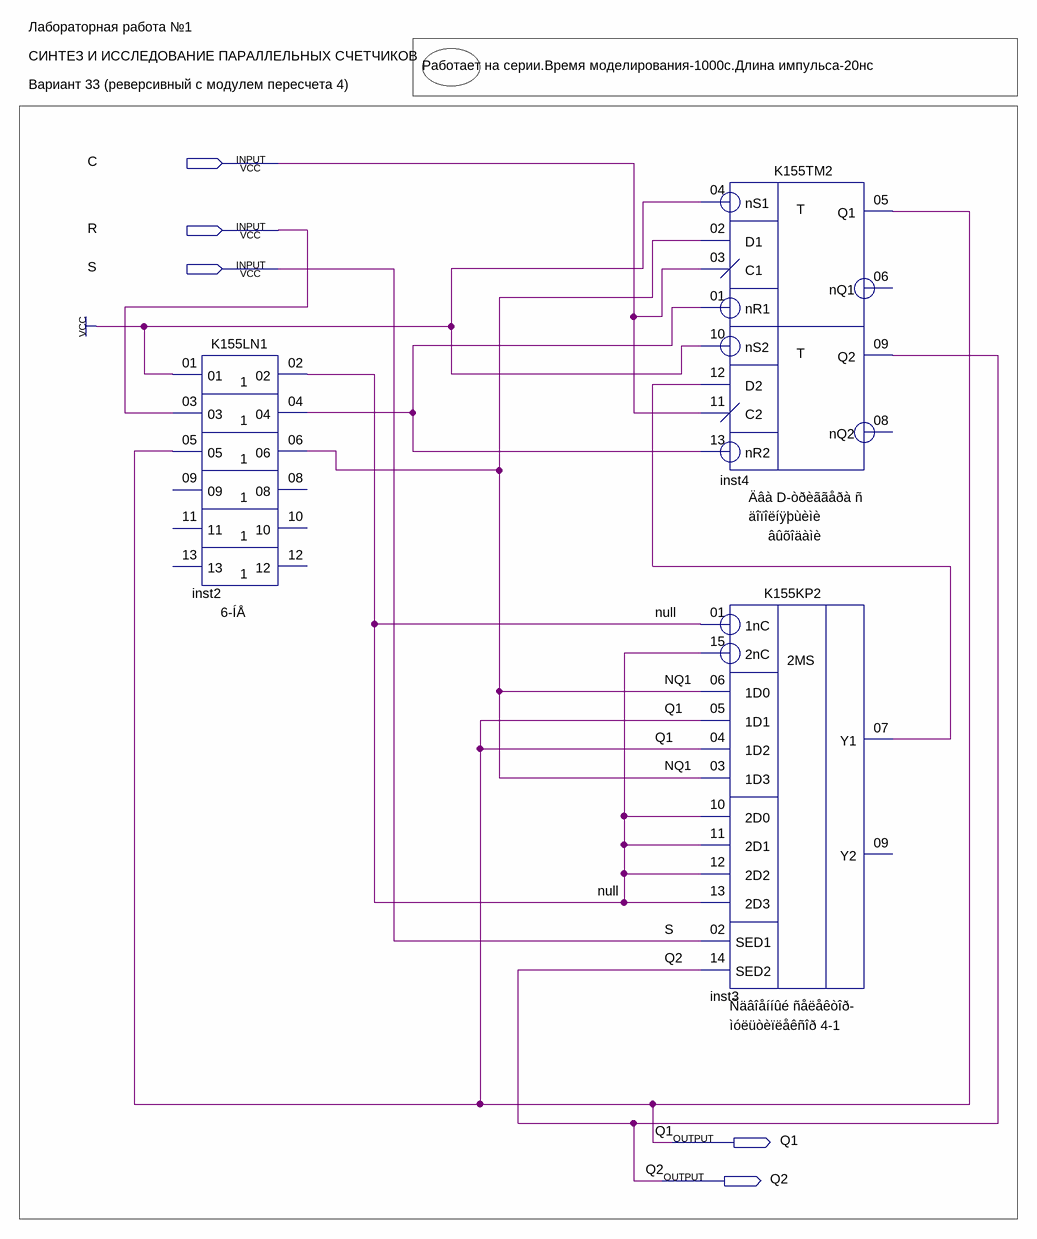
[diagram p0: schematic sheet]
// Quartus schematic 3_lab.bdf as structural Verilog: 3 symbols, 5 pins
module \3_lab  (
  input  C,
  input  R,
  input  S,
  output Q1,
  output Q2
);

  wire inst2_04, inst3_y1, NQ1, \null ;

  K155LN1 inst2 (
    .\01 (1'b1), .\03 (R), .\05 (Q1), .\02 (\null ), .\04 (inst2_04), .\06 (NQ1));  // open: 09, 11, 13, 08, 10, 12
  K155TM2 inst4 (
    .nS1(1'b1), .nR1(inst2_04), .C1(C), .D1(NQ1), .nS2(1'b1), .nR2(inst2_04), .C2(C), .D2(inst3_y1), .Q1(Q1),
    .Q2(Q2));  // open: nQ1, nQ2
  K155KP2 inst3 (
    .\1nC (\null ), .\1D0 (NQ1), .\1D1 (Q1), .\1D2 (Q1), .\1D3 (NQ1), .SED2(Q2), .SED1(S), .\2D0 (\null ),
    .\2D1 (\null ), .\2D2 (\null ), .\2D3 (\null ), .\2nC (\null ), .Y1(inst3_y1));  // open: Y2

  // Notes on the sheet:
  //   Лабораторная работа №1
  //   СИНТЕЗ И ИССЛЕДОВАНИЕ ПАРАЛЛЕЛЬНЫХ СЧЕТЧИКОВ
  //   Работает на серии.Время моделирования-1000с.Длина импульса-20нс
  //   Вариант 33 (реверсивный с модулем пересчета 4)
endmodule
